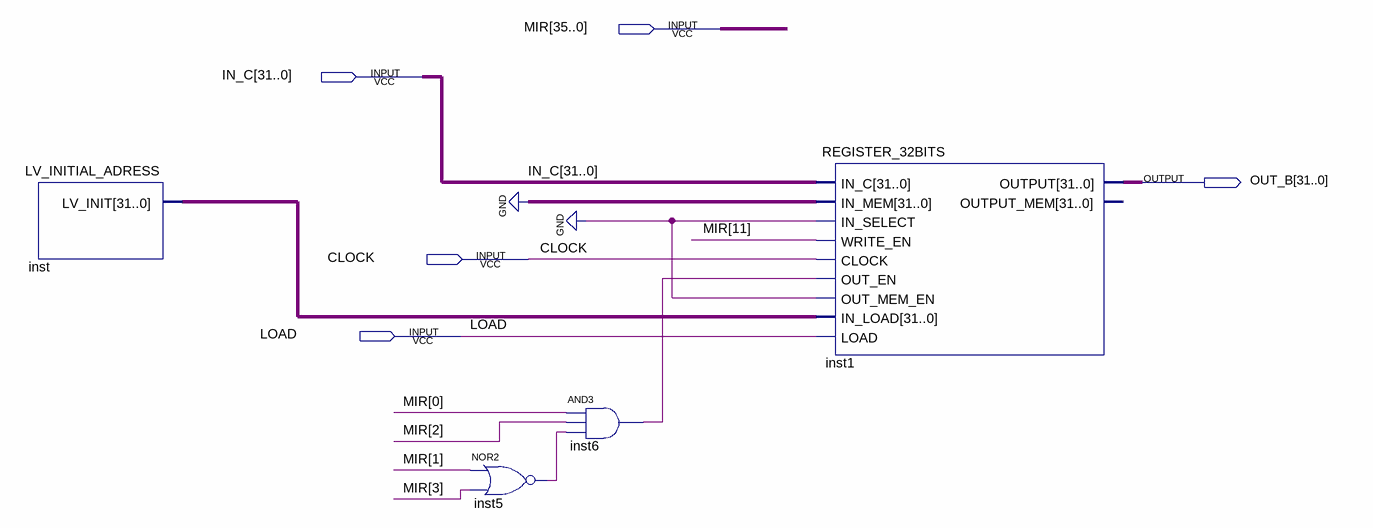
[diagram p0: schematic sheet]
// Quartus schematic LV.bdf as structural Verilog: 4 symbols, 5 pins
module LV (
  input  [35:0] MIR,
  input  [31:0] IN_C,
  input  CLOCK,
  input  LOAD,
  output [31:0] OUT_B
);

  wire inst5_out, inst6_out;
  wire [31:0] inst_lv_init;

  LV_INITIAL_ADRESS inst (.LV_INIT(inst_lv_init));
  nor inst5 (inst5_out, MIR[1], MIR[3]);
  and inst6 (inst6_out, MIR[0], MIR[2], inst5_out);
  REGISTER_32BITS inst1 (
    .IN_C(IN_C), .IN_MEM({32{1'b0}}), .IN_SELECT(1'b0), .WRITE_EN(MIR[11]), .CLOCK(CLOCK),
    .OUT_EN(inst6_out), .OUT_MEM_EN(1'b0), .IN_LOAD(inst_lv_init), .LOAD(LOAD), .OUTPUT(OUT_B));  // open: OUTPUT_MEM
endmodule
